# Altium project 虚拟离子电流.PRJPCB
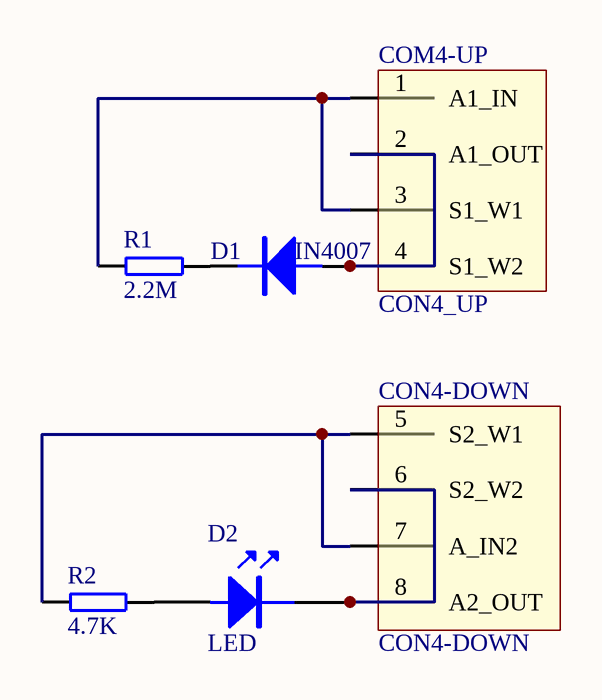
[diagram p0: 虚拟离子电流.SchDoc]
1 sheet, 6 parts. Net scope: global (net labels, ports and power ports of the same name join across sheets).
Board file: 虚拟离子电流.PcbDoc

## Sheet 虚拟离子电流.SchDoc
size A4

### Parts
COM4-UP  CON4_UP  [CON4_UP]
CON4-DOWN  CON4-DOWN  [CON4_DOWN]
D1  IN4007  [D]
D2  LED  [LED]
R1  2.2M  [R]
R2  4.7K  [R]

### Nets
NetCOM4-UP_1: COM4-UP.1(A1_IN) COM4-UP.3(S1_W1) R1.1
NetCOM4-UP_2: COM4-UP.2(A1_OUT) COM4-UP.4(S1_W2) D1.1
NetCON4-DOWN_5: CON4-DOWN.5(S2_W1) CON4-DOWN.7(A_IN2) R2.1
NetCON4-DOWN_6: CON4-DOWN.6(S2_W2) CON4-DOWN.8(A2_OUT) D2.K
NetD1_2: D1.2 R1.2
NetD2_A: D2.A R2.2

### Library data of the parts
D1 = DIODE
R1 R2 = RES2